# EAGLE schematic main (EAGLE 9.5.2)

## Sheet 1 of 2: Power
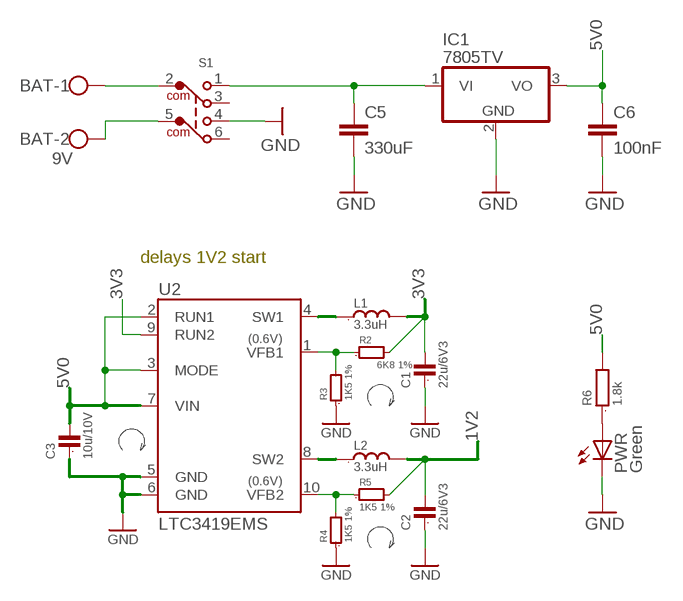
[diagram p0: schematic, sheet 1]

### Parts
BAT  9V  W237-102  [W237-102]
C1  22u/6V3  C0805  [0805]
C2  22u/6V3  C0805  [0805]
C3  10u/10V  C0805  [0805]
C5  330uF  C-EUC0805  [C0805]
C6  100nF  C-EUC0805  [C0805]
IC1  7805TV  [TO220V]
L1  3.3uH  L_VLS3015  [VLS3015]
L2  3.3uH  L_VLS3015  [VLS3015]
PWR  Green  LEDCHIP-LED0805  [CHIP-LED0805]
R2  6K8 1%  R-SMALL0603  [0603]
R3  1K5 1%  R-SMALL0603  [0603]
R4  1K5 1%  R-SMALL0603  [0603]
R5  1K5 1%  R-SMALL0603  [0603]
R6  1.8k  R0603  [0603]
S1  452404020202  [452404020202]
U2  LTC3419EMS  [MSOP10]

### Nets
1V2: C2.2 L2.2 R5.2 ; also sheet 2
3V3 [power]: C1.2 L1.2 R2.2 U2.9(RUN2) ; also sheet 2
5V0: C3.2 C6.1 IC1.3(VO) R6.2 U2.2(RUN1) U2.3(MODE) U2.7(VIN)
9V+ [power]: C5.1 IC1.1(VI) S1.1
BAT+ [power]: BAT.1 S1.2(COM)
BAT- [power]: BAT.2 S1.5(COM1)
FB_1V2: R4.2 R5.1 U2.10(VFB2)
FB_3V3: R2.1 R3.2 U2.1(VFB1)
GND [power]: C1.1 C2.1 C3.1 C5.2 C6.2 IC1.2(GND) PWR.C R3.1 R4.1 S1.4 U2.5(GND) U2.6(GND) ; also sheet 2
N$8: PWR.A R6.1
SW_1V2: L2.1 U2.8(SW2)
SW_3V3: L1.1 U2.4(SW1)
Unconnected: S1.3 S1.6

### Notes on the sheet
- delays 1V2 start

## Sheet 2 of 2: FPGA
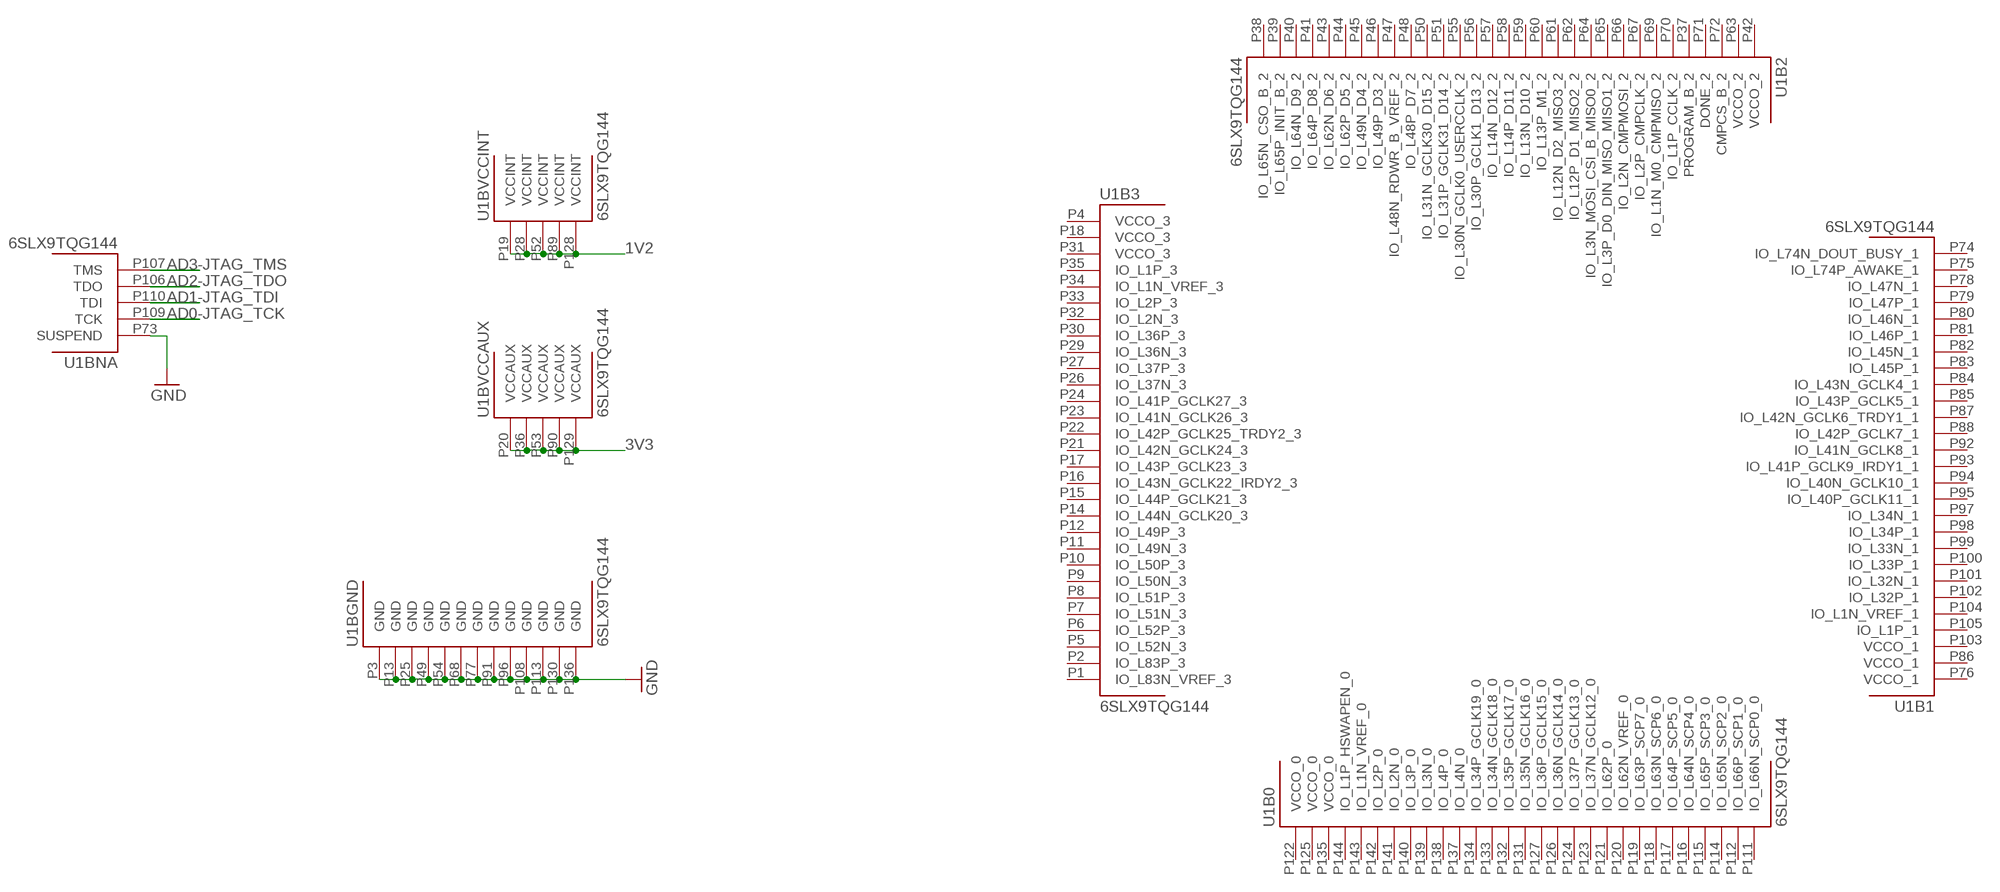
[diagram p1: schematic, sheet 2]

### Parts
U1  6SLX9TQG144  [TQ144]

### Nets
1V2: U1.P19(BVCCINT:VCCINT) U1.P28(BVCCINT:VCCINT) U1.P52(BVCCINT:VCCINT) U1.P89(BVCCINT:VCCINT) U1.P128(BVCCINT:VCCINT) ; also sheet 1
3V3 [power]: U1.P20(BVCCAUX:VCCAUX) U1.P36(BVCCAUX:VCCAUX) U1.P53(BVCCAUX:VCCAUX) U1.P90(BVCCAUX:VCCAUX) U1.P129(BVCCAUX:VCCAUX) ; also sheet 1
AD0-JTAG_TCK: U1.P109(BNA:TCK)
AD1-JTAG_TDI: U1.P110(BNA:TDI)
AD2-JTAG_TDO: U1.P106(BNA:TDO)
AD3-JTAG_TMS: U1.P107(BNA:TMS)
GND [power]: U1.P3(BGND:GND) U1.P13(BGND:GND) U1.P25(BGND:GND) U1.P49(BGND:GND) U1.P54(BGND:GND) U1.P68(BGND:GND) U1.P73(BNA:SUSPEND) U1.P77(BGND:GND) U1.P91(BGND:GND) U1.P96(BGND:GND) U1.P108(BGND:GND) U1.P113(BGND:GND) U1.P130(BGND:GND) U1.P136(BGND:GND) ; also sheet 1
Unconnected: U1.P1(B3:IO_L83N_VREF_3) U1.P2(B3:IO_L83P_3) U1.P4(B3:VCCO_3) U1.P5(B3:IO_L52N_3) U1.P6(B3:IO_L52P_3) U1.P7(B3:IO_L51N_3) U1.P8(B3:IO_L51P_3) U1.P9(B3:IO_L50N_3) U1.P10(B3:IO_L50P_3) U1.P11(B3:IO_L49N_3) U1.P12(B3:IO_L49P_3) U1.P14(B3:IO_L44N_GCLK20_3) U1.P15(B3:IO_L44P_GCLK21_3) U1.P16(B3:IO_L43N_GCLK22_IRDY2_3) U1.P17(B3:IO_L43P_GCLK23_3) U1.P18(B3:VCCO_3) U1.P21(B3:IO_L42N_GCLK24_3) U1.P22(B3:IO_L42P_GCLK25_TRDY2_3) U1.P23(B3:IO_L41N_GCLK26_3) U1.P24(B3:IO_L41P_GCLK27_3) U1.P26(B3:IO_L37N_3) U1.P27(B3:IO_L37P_3) U1.P29(B3:IO_L36N_3) U1.P30(B3:IO_L36P_3) U1.P31(B3:VCCO_3) U1.P32(B3:IO_L2N_3) U1.P33(B3:IO_L2P_3) U1.P34(B3:IO_L1N_VREF_3) U1.P35(B3:IO_L1P_3) U1.P37(B2:PROGRAM_B_2) U1.P38(B2:IO_L65N_CSO_B_2) U1.P39(B2:IO_L65P_INIT_B_2) U1.P40(B2:IO_L64N_D9_2) U1.P41(B2:IO_L64P_D8_2) U1.P42(B2:VCCO_2) U1.P43(B2:IO_L62N_D6_2) U1.P44(B2:IO_L62P_D5_2) U1.P45(B2:IO_L49N_D4_2) U1.P46(B2:IO_L49P_D3_2) U1.P47(B2:IO_L48N_RDWR_B_VREF_2) U1.P48(B2:IO_L48P_D7_2) U1.P50(B2:IO_L31N_GCLK30_D15_2) U1.P51(B2:IO_L31P_GCLK31_D14_2) U1.P55(B2:IO_L30N_GCLK0_USERCCLK_2) U1.P56(B2:IO_L30P_GCLK1_D13_2) U1.P57(B2:IO_L14N_D12_2) U1.P58(B2:IO_L14P_D11_2) U1.P59(B2:IO_L13N_D10_2) U1.P60(B2:IO_L13P_M1_2) U1.P61(B2:IO_L12N_D2_MISO3_2) U1.P62(B2:IO_L12P_D1_MISO2_2) U1.P63(B2:VCCO_2) U1.P64(B2:IO_L3N_MOSI_CSI_B_MISO0_2) U1.P65(B2:IO_L3P_D0_DIN_MISO_MISO1_2) U1.P66(B2:IO_L2N_CMPMOSI_2) U1.P67(B2:IO_L2P_CMPCLK_2) U1.P69(B2:IO_L1N_M0_CMPMISO_2) U1.P70(B2:IO_L1P_CCLK_2) U1.P71(B2:DONE_2) U1.P72(B2:CMPCS_B_2) U1.P74(B1:IO_L74N_DOUT_BUSY_1) U1.P75(B1:IO_L74P_AWAKE_1) U1.P76(B1:VCCO_1) U1.P78(B1:IO_L47N_1) U1.P79(B1:IO_L47P_1) U1.P80(B1:IO_L46N_1) U1.P81(B1:IO_L46P_1) U1.P82(B1:IO_L45N_1) U1.P83(B1:IO_L45P_1) U1.P84(B1:IO_L43N_GCLK4_1) U1.P85(B1:IO_L43P_GCLK5_1) U1.P86(B1:VCCO_1) U1.P87(B1:IO_L42N_GCLK6_TRDY1_1) U1.P88(B1:IO_L42P_GCLK7_1) U1.P92(B1:IO_L41N_GCLK8_1) U1.P93(B1:IO_L41P_GCLK9_IRDY1_1) U1.P94(B1:IO_L40N_GCLK10_1) U1.P95(B1:IO_L40P_GCLK11_1) U1.P97(B1:IO_L34N_1) U1.P98(B1:IO_L34P_1) U1.P99(B1:IO_L33N_1) U1.P100(B1:IO_L33P_1) U1.P101(B1:IO_L32N_1) U1.P102(B1:IO_L32P_1) U1.P103(B1:VCCO_1) U1.P104(B1:IO_L1N_VREF_1) U1.P105(B1:IO_L1P_1) U1.P111(B0:IO_L66N_SCP0_0) U1.P112(B0:IO_L66P_SCP1_0) U1.P114(B0:IO_L65N_SCP2_0) U1.P115(B0:IO_L65P_SCP3_0) U1.P116(B0:IO_L64N_SCP4_0) U1.P117(B0:IO_L64P_SCP5_0) U1.P118(B0:IO_L63N_SCP6_0) U1.P119(B0:IO_L63P_SCP7_0) U1.P120(B0:IO_L62N_VREF_0) U1.P121(B0:IO_L62P_0) U1.P122(B0:VCCO_0) U1.P123(B0:IO_L37N_GCLK12_0) U1.P124(B0:IO_L37P_GCLK13_0) U1.P125(B0:VCCO_0) U1.P126(B0:IO_L36N_GCLK14_0) U1.P127(B0:IO_L36P_GCLK15_0) U1.P131(B0:IO_L35N_GCLK16_0) U1.P132(B0:IO_L35P_GCLK17_0) U1.P133(B0:IO_L34N_GCLK18_0) U1.P134(B0:IO_L34P_GCLK19_0) U1.P135(B0:VCCO_0) U1.P137(B0:IO_L4N_0) U1.P138(B0:IO_L4P_0) U1.P139(B0:IO_L3N_0) U1.P140(B0:IO_L3P_0) U1.P141(B0:IO_L2N_0) U1.P142(B0:IO_L2P_0) U1.P143(B0:IO_L1N_VREF_0) U1.P144(B0:IO_L1P_HSWAPEN_0)

## Library data of the parts
BAT = con-wago-500:W237-102: WAGO SCREW CLAMP; MPN: 237-102; OC_FARNELL: unknown; OC_NEWARK: 70K9898
C1 C2 = Bogdan_Commons:C: CAPACITOR, European symbol; PARTNO: GRM21BR60J226ME39L
C3 = Bogdan_Commons:C: CAPACITOR, European symbol; PARTNO: C0805C106K9PACTU
C5 C6 = rcl:C-EU: CAPACITOR, European symbol; SPICEPREFIX: C
IC1 = linear:78*: Positive VOLTAGE REGULATOR Source: http://cache.national.com/ds/LM/LM78L05.pdf http://www.fairchildsemi.com/ds/LM/LM7805.pdf
L1 L2 = Bogdan_Commons:L: INDUCTOR, European symbol; PARTNO: VLS3015T-3R3M1R2
PWR = led:LED: LED OSRAM: - CHIPLED LG R971, LG N971, LY N971, LG Q971, LY Q971, LO R971, LY R971 LH N974, LH R974 LS Q976, LO Q976, LY Q976 LO Q996 - Hyper CHIPLED LW Q18S LB Q993, LB Q99A, LB R99A - SideLED LS A670, LO A670, LY A670, LG A670, LP A670 LB A673, LV A673, LT A673, LW A673 LH A674 LY A675 LS A676, LA A676, LO A676, LY A676, LW A676 LS A679, LY A679, LG A679 - Hyper Micro SIDELED� LS Y876, LA Y876, LO Y876, LY Y876 LT Y87S - SmartLED LW L88C, LW L88S LB L89C, LB L89S, LG L890 LS L89K, LO L89K, LY L89K LS L896, LA L896, LO L896, LY L896 - TOPLED LS T670, LO T670, LY T670, LG T670, LP T670 LSG T670, LSP T670, LSY T670, LOP T670, LYG T670 LG T671, LOG T671, LSG T671 LB T673, LV T673, LT T673, LW T673 LH T674 LS T676, LA T676, LO T676, LY T676, LB T676, LH T676, LSB T676, LW T676 LB T67C, LV T67C, LT T67C, LS T67K, LO T67K, LY T67K, LW E67C LS E67B, LA E67B, LO E67B, LY E67B, LB E67C, LV E67C, LT E67C LW T67C LS T679, LY T679, LG T679 LS T770, LO T770, LY T770, LG T770, LP T770 LB T773, LV T773, LT T773, LW T773 LH T774 LS E675, LA E675, LY E675, LS T675 LS T776, LA T776, LO T776, LY T776, LB T776 LHGB T686 LT T68C, LB T68C - Hyper Mini TOPLED� LB M676 - Mini TOPLED Santana� LG M470 LS M47K, LO M47K, LY M47K Source: http://www.osram.convergy.de LUXEON: - LUMILED� LXK2-PW12-R00, LXK2-PW12-S00, LXK2-PW14-U00, LXK2-PW14-V00 LXK2-PM12-R00, LXK2-PM12-S00, LXK2-PM14-U00 LXK2-PE12-Q00, LXK2-PE12-R00, LXK2-PE12-S00, LXK2-PE14-T00, LXK2-PE14-U00 LXK2-PB12-K00, LXK2-PB12-L00, LXK2-PB12-M00, LXK2-PB14-N00, LXK2-PB14-P00, LXK2-PB14-Q00 LXK2-PR12-L00, LXK2-PR12-M00, LXK2-PR14-Q00, LXK2-PR14-R00 LXK2-PD12-Q00, LXK2-PD12-R00, LXK2-PD12-S00 LXK2-PH12-R00, LXK2-PH12-S00 LXK2-PL12-P00, LXK2-PL12-Q00, LXK2-PL12-R00 Source: www.luxeon.com KINGBRIGHT: KA-3528ASYC Source: www.kingbright.com; PARTNO: LTST-C171EKT
R2 = Bogdan_Commons:R-SMALL; PARTNO: CRCW06036K80FKEA
R3-R5 = Bogdan_Commons:R-SMALL; PARTNO: CRCW06031K50FKEA
R6 = GadgetFactory:R: RESISTOR, European symbol; PARTNO: RMCF0603JT1K80
S1 = Wurth_Switch_WS-SLTV:452404020202: WS-SLTV THT Mini Slide Switch, Same Side Connection 9.0x3.5 mm Properties Actuator Material:PA9T Actuator Flammability Rating:UL94 HB Actuator Color:Black Frame Material:LCP Frame Flammability Rating:UL94 V-0 Frame Color:Black Contact Material:Copper Alloy Contact Plating:Silver Terminal Material:Copper Alloy Terminal Plating:Silver Schematic:DPDT Switching Function:On-On Connection Type:Same Side Connection Operating Temperature:-40 up to +85 °C Qty.:200 Material Properties Cover Material :Stainless Steel Mechanical Properties Electrical Life:2000 Steps Switching Function:On-On Connection Type:Same Side Connection Packaging Properties Packaging :Bulk <https://www.we-online.com/catalog/media/o107346v209%20Family_WS-SLTV_452404020202.jpg> Details see: https://www.we-online.com/catalog/en/SLTV_9X3_5_THT/ Updated by yingchun,Shan;2020-02-24 2020(C) Würth Elektronik; DATASHEET-URL: https://www.we-online.com/catalog/datasheet/452404020202.pdf; PACKAGING: Bulk; PART-NUMBER: 452404020202; QTY: 200
U1 = xilinx_devices_V6:6SLX9TQG144: Xilinx FPGA: 6SLX9TQG144
U2 = Bogdan_Commons:LTC3419: Dual Monolithic 600mA Synchronous Step-Down Regulator; PARTNO: LTC3419EMS#PBF

## Net classes
0 default: width 0.178 mm, drill 0.381 mm, clearance 0.178 mm
1 power: width 0.508 mm